# EAGLE board GDPHS_VGA - v1.3 (EAGLE 7.3.0), part 1 of 2
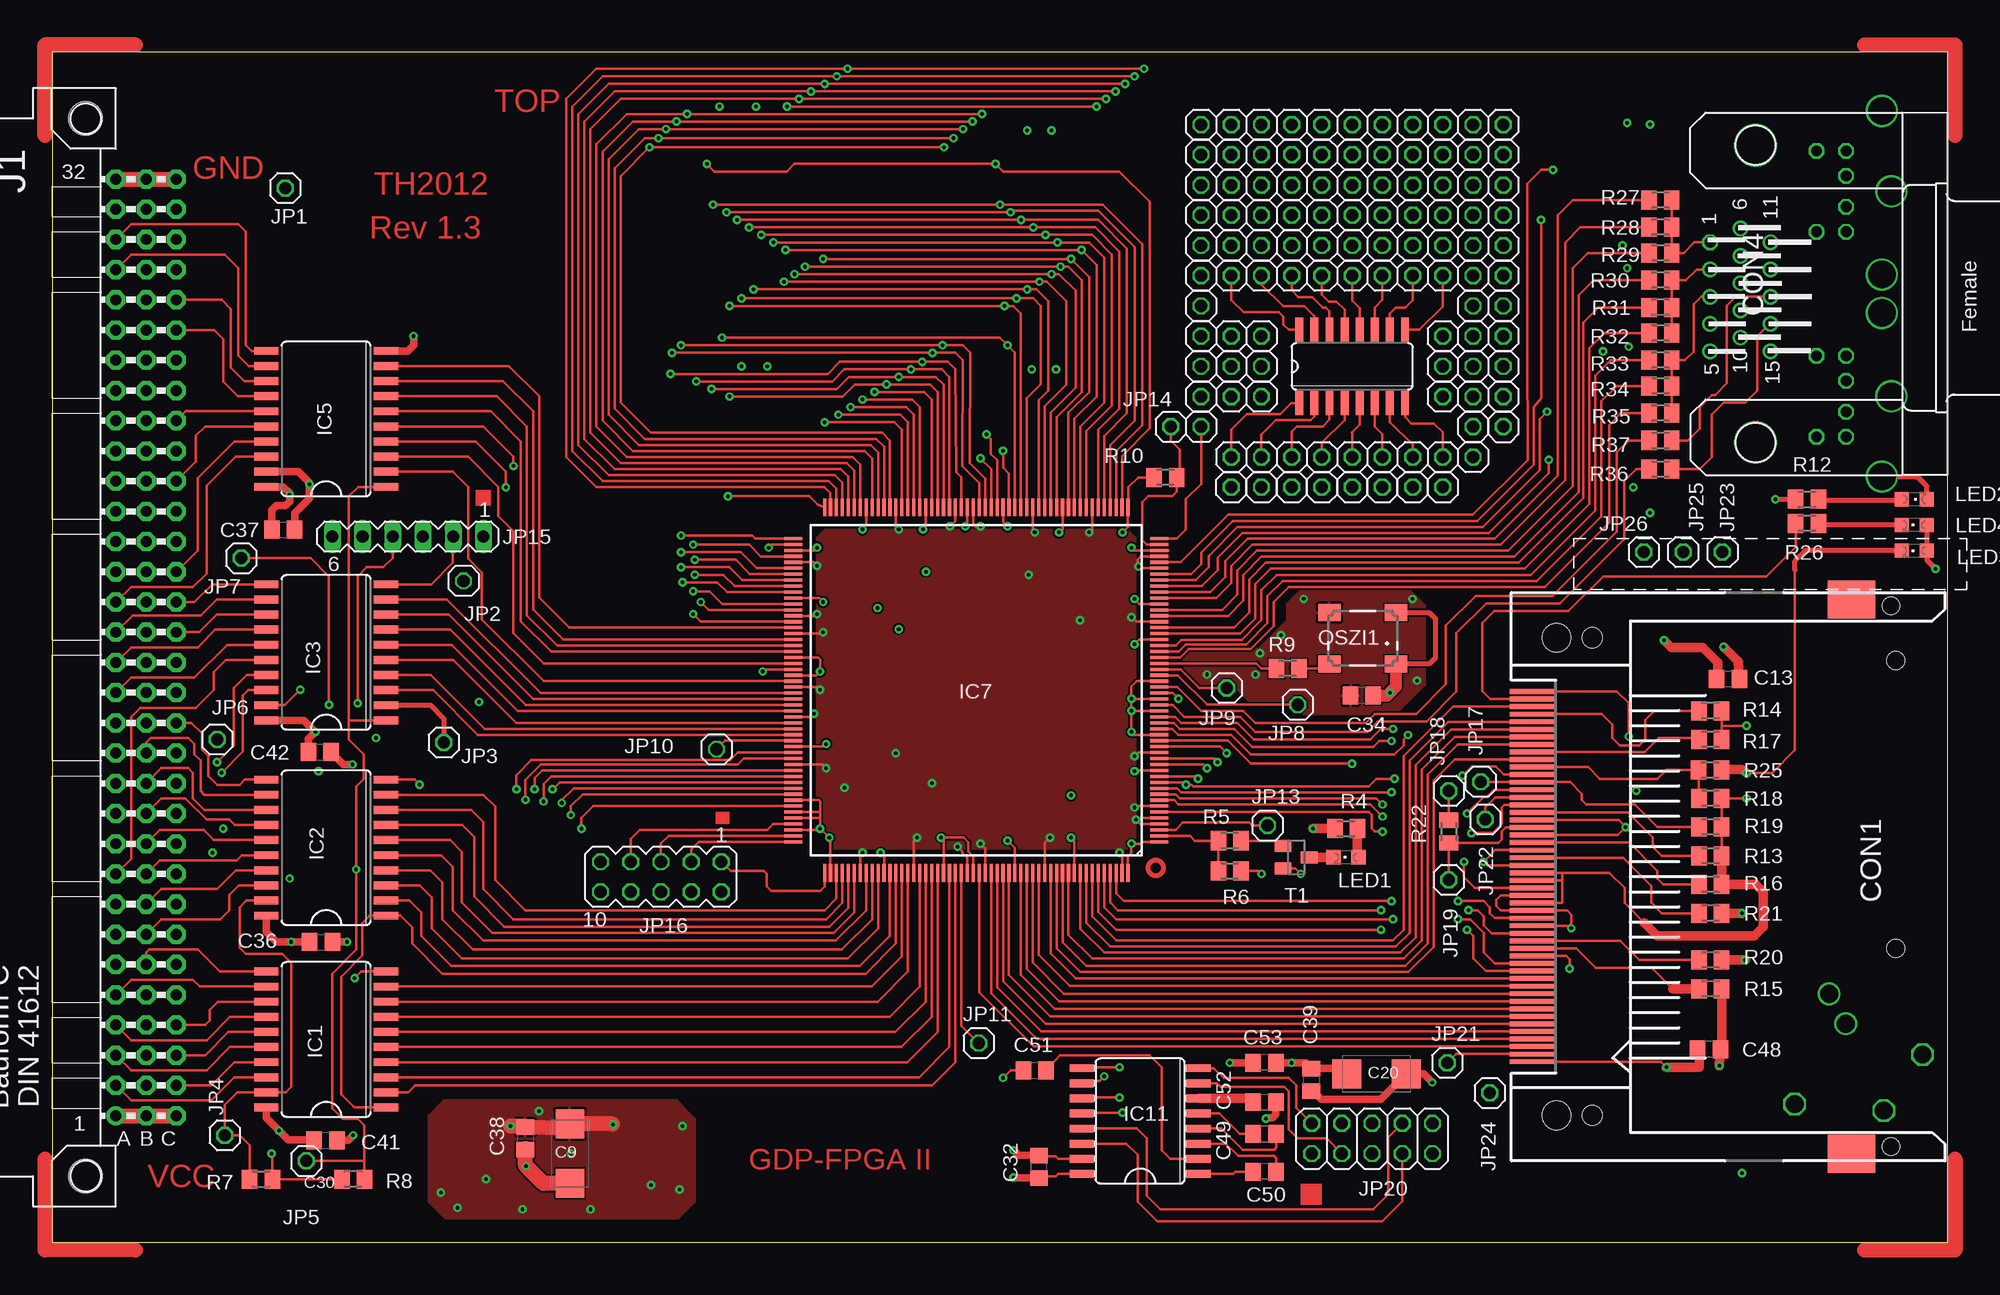
[diagram p5: board, top side]
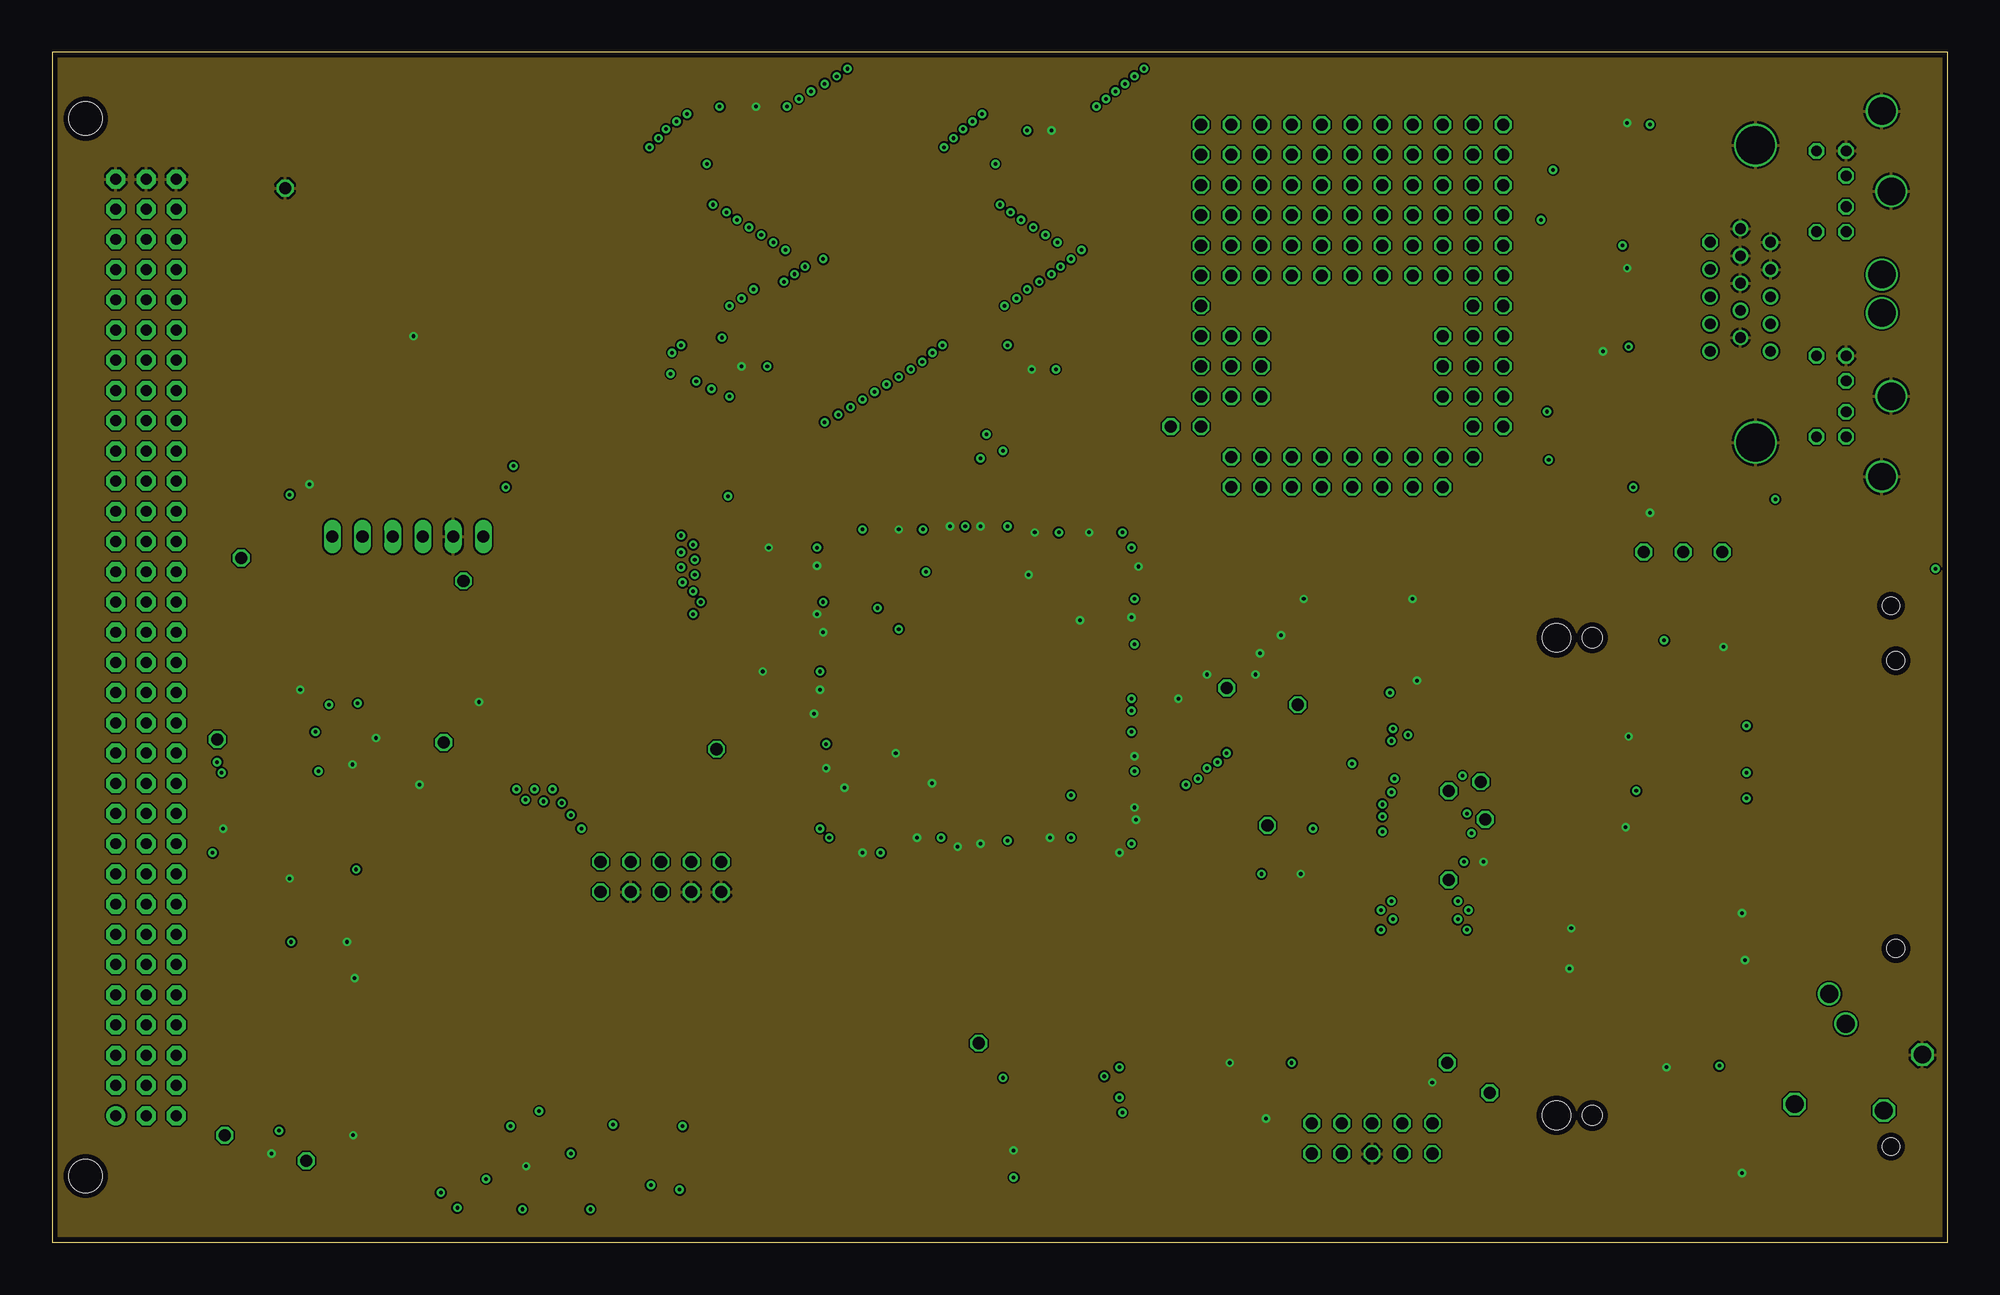
[diagram p6: board, inner layer GND$]
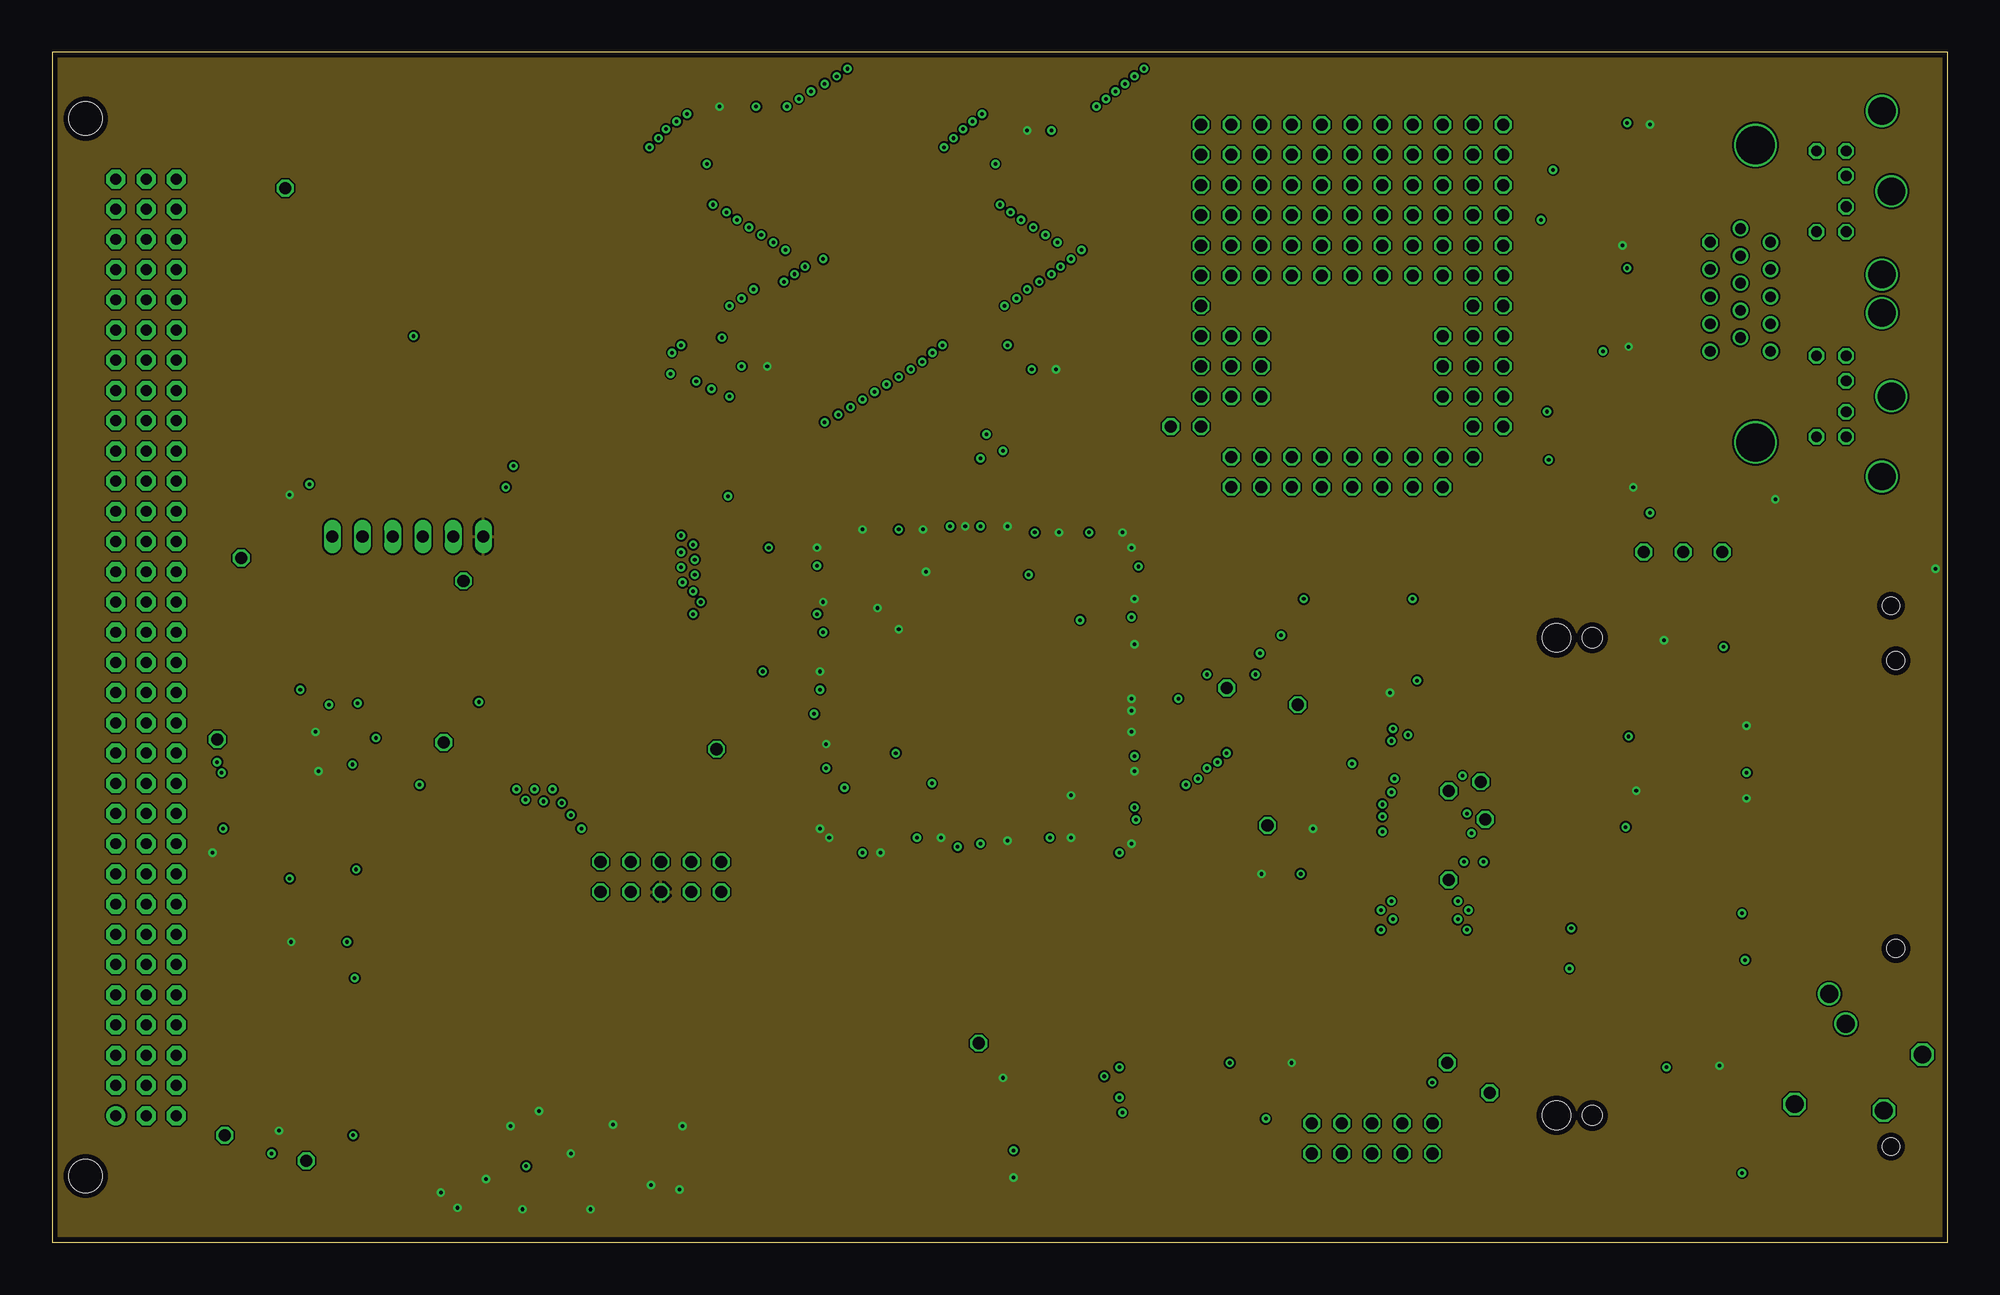
[diagram p7: board, inner layer VCC$]
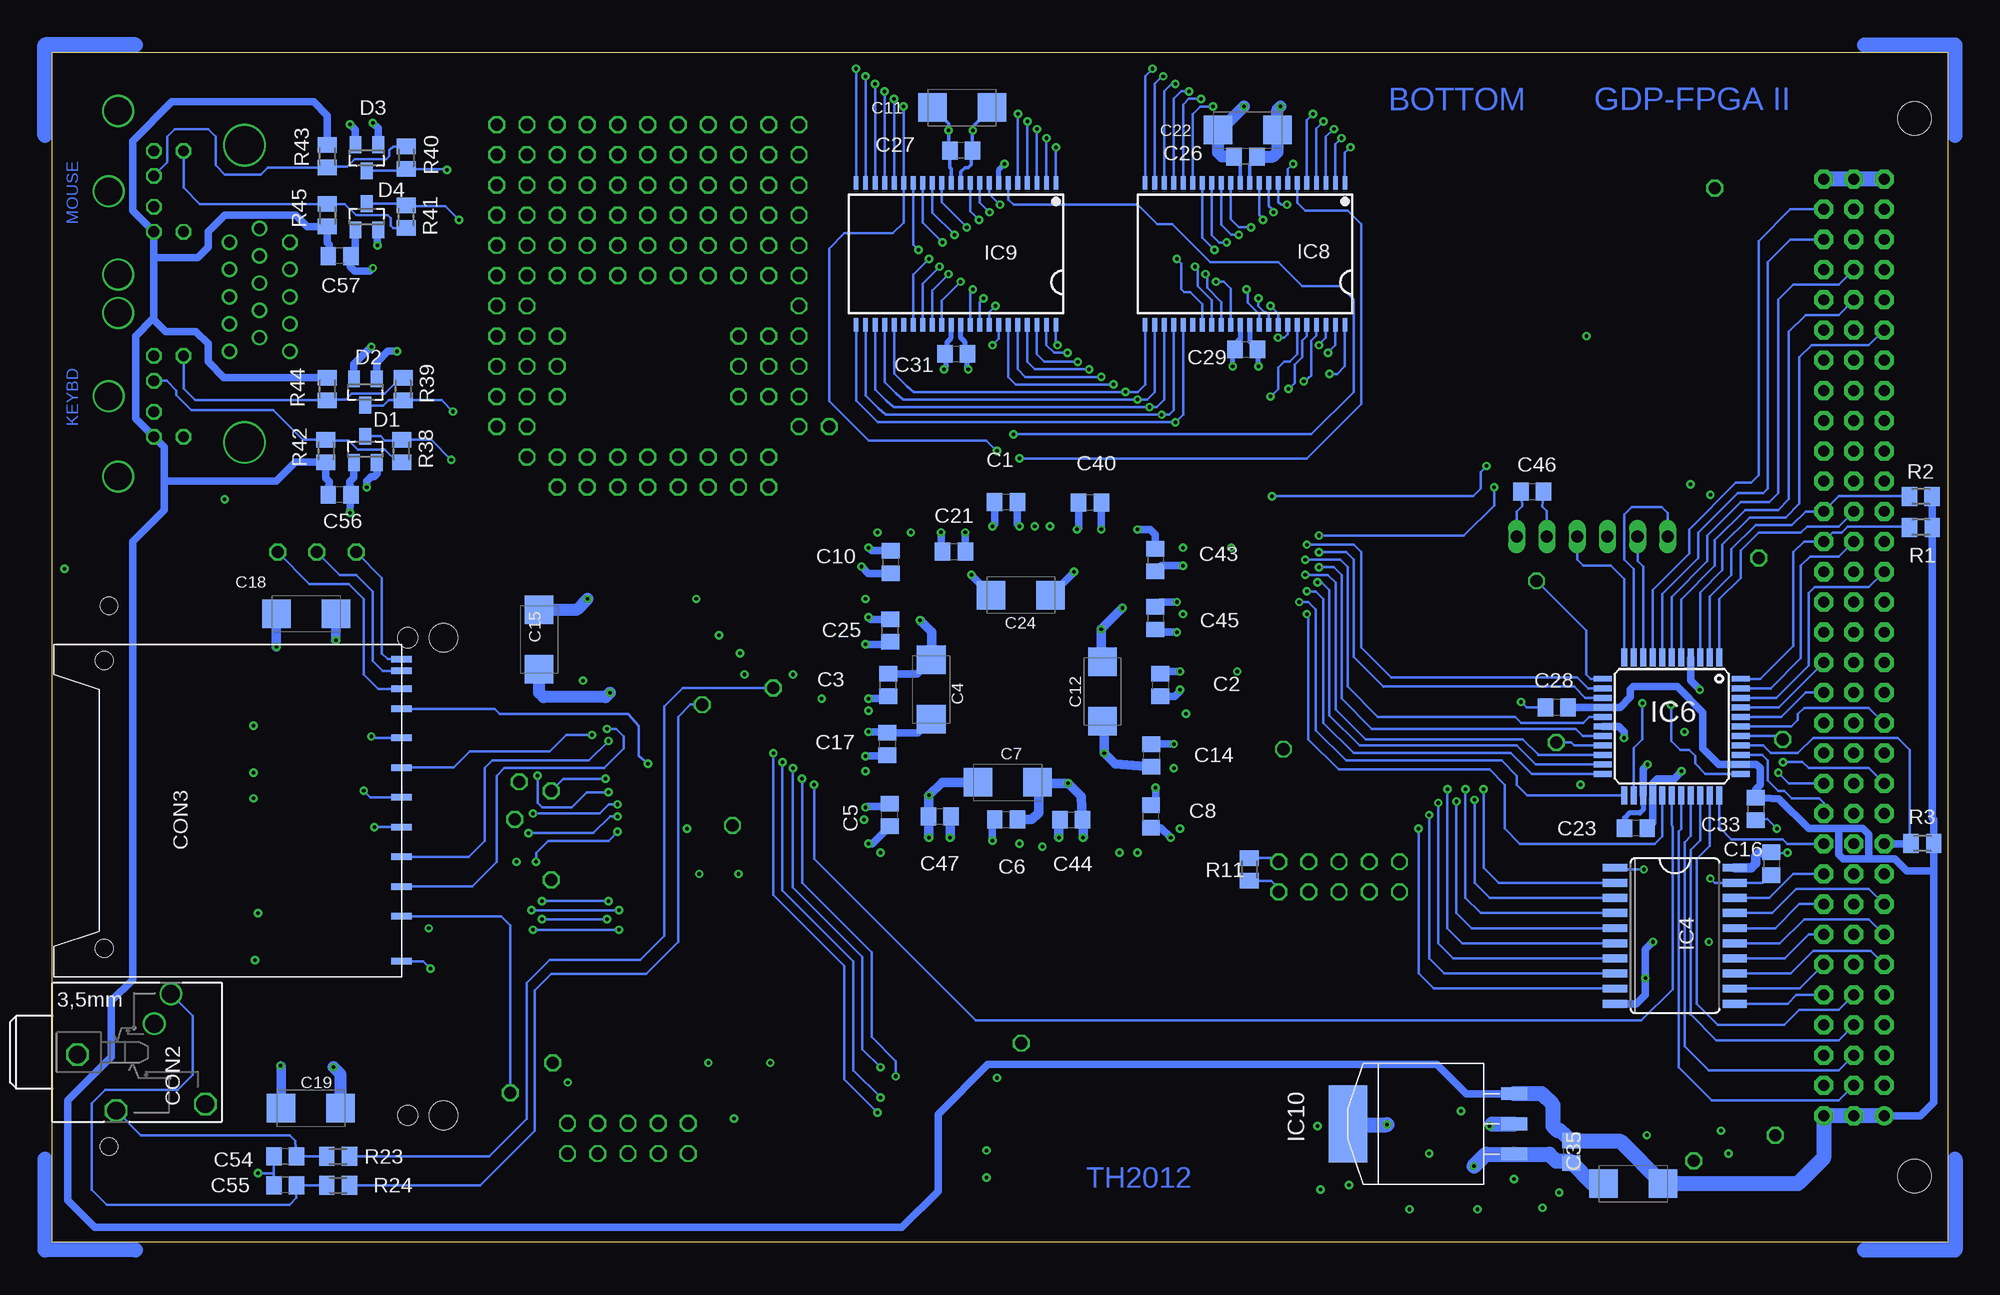
[diagram p8: board, bottom side, seen from below]

Size 159.26 x 100.03 mm. Coordinates in mm from the lower left corner, seen from the top.
Copper layers (1*2*3*16): Top 0.018mm / dielectric 0.36mm / GND$ 0.035mm / dielectric 0.71mm / VCC$ 0.035mm / dielectric 0.36mm / Bottom 0.018mm
Design rules "default": minimum track width 0.15mm, minimum drill 0.25mm, track to track 0.15mm, track to pad 0.15mm, pad to pad 0.15mm, via to via 0.15mm, smd to smd 0.15mm, copper to edge 0.45mm, drill to drill 0.3mm, minimum pad ring 0.2mm, minimum via ring 0.2mm, stop-mask expansion 0.1mm, vias tented up to drill 0mil, thermal gap 0.2mm

## Footprints (pad centres in the part's own frame; a part is rotated, then mirrored left to right if it is on the bottom)
C0805 = smd 1.3 x 1.5: 1 -0.95,0; 2 0.95,0
SMC_C = smd 2.4 x 2.4: + -2.5,0; - 2.5,0
CF-050-P2-X03-10-DS-1 = smd 0.41 x 3.75: 1 15.557,0.27; 2 14.287,0.27; 3 13.018,0.27; 4 11.748,0.27; 5 10.477,0.27; 6 9.207,0.27; 7 7.938,0.27; 8 6.668,0.27; 9 5.397,0.27; 10 4.128,0.27; 11 2.857,0.27; 12 1.587,0.27; 13 0.318,0.27; 14 -0.953,0.27; 15 -2.223,0.27; 16 -3.493,0.27; 17 -4.763,0.27; 18 -6.032,0.27; 19 -7.303,0.27; 20 -8.572,0.27; 21 -9.842,0.27; 22 -11.113,0.27; 23 -12.383,0.27; 24 -13.652,0.27; 25 -14.922,0.27; 26 14.922,0.27; 27 13.652,0.27; 28 12.383,0.27; 29 11.113,0.27; 30 9.842,0.27; 31 8.572,0.27; 32 7.303,0.27; 33 6.032,0.27; 34 4.763,0.27; 35 3.493,0.27; 36 2.223,0.27; 37 0.953,0.27; 38 -0.318,0.27; 39 -1.587,0.27; 40 -2.857,0.27; 41 -4.128,0.27; 42 -5.397,0.27; 43 -6.668,0.27; 44 -7.938,0.27; 45 -9.207,0.27; 46 -10.477,0.27; 47 -11.748,0.27; 48 -13.018,0.27; 49 -14.287,0.27; 50 -15.557,0.27 | smd 3.2 x 4: M1 -23.3,27.15; M2 23.3,27.15 | hole 1.676: 20.08,5.35; -20.08,5.35 | hole 1.422: -22.77,30.45; 22.7,30.45 | hole 2.4: -20.08,2.35; 20.08,2.35
PG203J = drill 1.499 octagon: 1 -5.004,-0.203; 4 5.74,-4.369; 5 -1.753,-4.902 | drill 1.499: 2 2.845,4.902; 3 1.448,2.388
FPS-009-2405-0 = smd 0.55 x 1.7: 1 2.5,0; 2 5,0; 3 7.5,0; 4 10,0; 5 12.5,0; 6 15,0; 7 17.43,0; 8 19.12,0; 9 0,0; CD 20.62,0; S1 -3.78,0; WP 21.62,0 | hole 1.5: -2.72,25; 21.48,25
MDSSV-BD06-HF15-B = drill 0.9 octagon: 1 4.331,12.311; 1-1 -7.314,0.881; 1-2 -9.915,0.881; 1-3 -5.213,0.881; 1-4 -12.015,0.881; 1-5 -5.213,3.381; 1-6 -12.015,3.381; 2-1 9.915,0.881; 2-2 7.314,0.881; 2-3 12.015,0.881; 2-4 5.213,0.881; 2-5 12.015,3.381; 2-6 5.213,3.381 | drill 0.9: 2 2.04,12.311; 3 -0.252,12.311; 4 -2.542,12.311; 5 -4.834,12.311; 6 5.476,9.771; 7 3.185,9.771; 8 0.894,9.771; 9 -1.397,9.771; 10 -3.688,9.771; 11 4.331,7.231; 12 2.04,7.231; 13 -0.252,7.231; 14 -2.542,7.231; 15 -4.834,7.231 | drill 2.301: S1 -15.367,-2.118; S2 -8.616,-2.918; S3 8.616,-2.918; S4 15.367,-2.118; S7 -1.615,-2.118; S8 1.615,-2.118 | drill 3.2: S5 12.495,8.501; S6 -12.495,8.501
SOT23 = smd 1 x 1.4: 1 -0.95,-1.1; 2 0.95,-1.1; 3 0,1.1
SO20W = smd 0.66 x 2.032: 1 -5.715,-5.029; 2 -4.445,-5.029; 3 -3.175,-5.029; 4 -1.905,-5.029; 5 -0.635,-5.029; 6 0.635,-5.029; 7 1.905,-5.029; 8 3.175,-5.029; 9 4.445,-5.029; 10 5.715,-5.029; 11 5.715,5.029; 12 4.445,5.029; 13 3.175,5.029; 14 1.905,5.029; 15 0.635,5.029; 16 -0.635,5.029; 17 -1.905,5.029; 18 -3.175,5.029; 19 -4.445,5.029; 20 -5.715,5.029
TQFP44 = smd 1.5 x 0.5: 1 -5.8,4; 2 -5.8,3.2; 3 -5.8,2.4; 4 -5.8,1.6; 5 -5.8,0.8; 6 -5.8,0; 7 -5.8,-0.8; 8 -5.8,-1.6; 9 -5.8,-2.4; 10 -5.8,-3.2; 11 -5.8,-4; 23 5.8,-4; 24 5.8,-3.2; 25 5.8,-2.4; 26 5.8,-1.6; 27 5.8,-0.8; 28 5.8,0; 29 5.8,0.8; 30 5.8,1.6; 31 5.8,2.4; 32 5.8,3.2; 33 5.8,4 | smd 0.5 x 1.5: 12 -4,-5.8; 13 -3.2,-5.8; 14 -2.4,-5.8; 15 -1.6,-5.8; 16 -0.8,-5.8; 17 0,-5.8; 18 0.8,-5.8; 19 1.6,-5.8; 20 2.4,-5.8; 21 3.2,-5.8; 22 4,-5.8; 34 4,5.8; 35 3.2,5.8; 36 2.4,5.8; 37 1.6,5.8; 38 0.8,5.8; 39 0,5.8; 40 -0.8,5.8; 41 -1.6,5.8; 42 -2.4,5.8; 43 -3.2,5.8; 44 -4,5.8
PQFP_208 = smd 1.5 x 0.26: 1 -15.367,12.75; 2 -15.367,12.25; 3 -15.367,11.75; 4 -15.367,11.25; 5 -15.367,10.75; 6 -15.367,10.25; 7 -15.367,9.75; 8 -15.367,9.25; 9 -15.367,8.75; 10 -15.367,8.25; 11 -15.367,7.75; 12 -15.367,7.25; 13 -15.367,6.75; 14 -15.367,6.25; 15 -15.367,5.75; 16 -15.367,5.25; 17 -15.367,4.75; 18 -15.367,4.25; 19 -15.367,3.75; 20 -15.367,3.25; 21 -15.367,2.75; 22 -15.367,2.25; 23 -15.367,1.75; 24 -15.367,1.25; 25 -15.367,0.75; 26 -15.367,0.25; 27 -15.367,-0.25; 28 -15.367,-0.75; 29 -15.367,-1.25; 30 -15.367,-1.75; 31 -15.367,-2.25; 32 -15.367,-2.75; 33 -15.367,-3.25; 34 -15.367,-3.75; 35 -15.367,-4.25; 36 -15.367,-4.75; 37 -15.367,-5.25; 38 -15.367,-5.75; 39 -15.367,-6.25; 40 -15.367,-6.75; 41 -15.367,-7.25; 42 -15.367,-7.75; 43 -15.367,-8.25; 44 -15.367,-8.75; 45 -15.367,-9.25; 46 -15.367,-9.75; 47 -15.367,-10.25; 48 -15.367,-10.75; 49 -15.367,-11.25; 50 -15.367,-11.75; 51 -15.367,-12.25; 52 -15.367,-12.75; 105 15.367,-12.75; 106 15.367,-12.25; 107 15.367,-11.75; 108 15.367,-11.25; 109 15.367,-10.75; 110 15.367,-10.25; 111 15.367,-9.75; 112 15.367,-9.25; 113 15.367,-8.75; 114 15.367,-8.25; 115 15.367,-7.75; 116 15.367,-7.25; 117 15.367,-6.75; 118 15.367,-6.25; 119 15.367,-5.75; 120 15.367,-5.25; 121 15.367,-4.75; 122 15.367,-4.25; 123 15.367,-3.75; 124 15.367,-3.25; 125 15.367,-2.75; 126 15.367,-2.25; 127 15.367,-1.75; 128 15.367,-1.25; 129 15.367,-0.75; 130 15.367,-0.25; 131 15.367,0.25; 132 15.367,0.75; 133 15.367,1.25; 134 15.367,1.75; 135 15.367,2.25; 136 15.367,2.75; 137 15.367,3.25; 138 15.367,3.75; 139 15.367,4.25; 140 15.367,4.75; 141 15.367,5.25; 142 15.367,5.75; 143 15.367,6.25; 144 15.367,6.75; 145 15.367,7.25; 146 15.367,7.75; 147 15.367,8.25; 148 15.367,8.75; 149 15.367,9.25; 150 15.367,9.75; 151 15.367,10.25; 152 15.367,10.75; 153 15.367,11.25; 154 15.367,11.75; 155 15.367,12.25; 156 15.367,12.75 | smd 0.26 x 1.5: 53 -12.75,-15.367; 54 -12.25,-15.367; 55 -11.75,-15.367; 56 -11.25,-15.367; 57 -10.75,-15.367; 58 -10.25,-15.367; 59 -9.75,-15.367; 60 -9.25,-15.367; 61 -8.75,-15.367; 62 -8.25,-15.367; 63 -7.75,-15.367; 64 -7.25,-15.367; 65 -6.75,-15.367; 66 -6.25,-15.367; 67 -5.75,-15.367; 68 -5.25,-15.367; 69 -4.75,-15.367; 70 -4.25,-15.367; 71 -3.75,-15.367; 72 -3.25,-15.367; 73 -2.75,-15.367; 74 -2.25,-15.367; 75 -1.75,-15.367; 76 -1.25,-15.367; 77 -0.75,-15.367; 78 -0.25,-15.367; 79 0.25,-15.367; 80 0.75,-15.367; 81 1.25,-15.367; 82 1.75,-15.367; 83 2.25,-15.367; 84 2.75,-15.367; 85 3.25,-15.367; 86 3.75,-15.367; 87 4.25,-15.367; 88 4.75,-15.367; 89 5.25,-15.367; 90 5.75,-15.367; 91 6.25,-15.367; 92 6.75,-15.367; 93 7.25,-15.367; 94 7.75,-15.367; 95 8.25,-15.367; 96 8.75,-15.367; 97 9.25,-15.367; 98 9.75,-15.367; 99 10.25,-15.367; 100 10.75,-15.367; 101 11.25,-15.367; 102 11.75,-15.367; 103 12.25,-15.367; 104 12.75,-15.367; 157 12.75,15.367; 158 12.25,15.367; 159 11.75,15.367; 160 11.25,15.367; 161 10.75,15.367; 162 10.25,15.367; 163 9.75,15.367; 164 9.25,15.367; 165 8.75,15.367; 166 8.25,15.367; 167 7.75,15.367; 168 7.25,15.367; 169 6.75,15.367; 170 6.25,15.367; 171 5.75,15.367; 172 5.25,15.367; 173 4.75,15.367; 174 4.25,15.367; 175 3.75,15.367; 176 3.25,15.367; 177 2.75,15.367; 178 2.25,15.367; 179 1.75,15.367; 180 1.25,15.367; 181 0.75,15.367; 182 0.25,15.367; 183 -0.25,15.367; 184 -0.75,15.367; 185 -1.25,15.367; 186 -1.75,15.367; 187 -2.25,15.367; 188 -2.75,15.367; 189 -3.25,15.367; 190 -3.75,15.367; 191 -4.25,15.367; 192 -4.75,15.367; 193 -5.25,15.367; 194 -5.75,15.367; 195 -6.25,15.367; 196 -6.75,15.367; 197 -7.25,15.367; 198 -7.75,15.367; 199 -8.25,15.367; 200 -8.75,15.367; 201 -9.25,15.367; 202 -9.75,15.367; 203 -10.25,15.367; 204 -10.75,15.367; 205 -11.25,15.367; 206 -11.75,15.367; 207 -12.25,15.367; 208 -12.75,15.367
TSOP44-400 = smd 0.406 x 1.143: 1 -10.4,-5.969; 2 -9.6,-5.969; 3 -8.8,-5.969; 4 -8,-5.969; 5 -7.2,-5.969; 6 -6.4,-5.969; 7 -5.6,-5.969; 8 -4.8,-5.969; 9 -4,-5.969; 10 -3.2,-5.969; 11 -2.4,-5.969; 12 -1.6,-5.969; 13 -0.8,-5.969; 14 0,-5.969; 15 0.8,-5.969; 16 1.6,-5.969; 17 2.4,-5.969; 18 3.2,-5.969; 19 4,-5.969; 20 4.8,-5.969; 21 5.6,-5.969; 22 6.4,-5.969; 23 6.4,5.969; 24 5.6,5.969; 25 4.8,5.969; 26 4,5.969; 27 3.2,5.969; 28 2.4,5.969; 29 1.6,5.969; 30 0.8,5.969; 31 0,5.969; 32 -0.8,5.969; 33 -1.6,5.969; 34 -2.4,5.969; 35 -3.2,5.969; 36 -4,5.969; 37 -4.8,5.969; 38 -5.6,5.969; 39 -6.4,5.969; 40 -7.2,5.969; 41 -8,5.969; 42 -8.8,5.969; 43 -9.6,5.969; 44 -10.4,5.969
MDD = smd 1.067 x 2.184: 1 0,0; 2 2.54,0; 3 5.08,0 | smd 6.452 x 3.251: 4 2.54,13.97
SO16L = smd 0.66 x 2.032: 1 -4.445,-4.902; 2 -3.175,-4.902; 3 -1.905,-4.902; 4 -0.635,-4.902; 5 0.635,-4.902; 6 1.905,-4.902; 7 3.175,-4.902; 8 4.445,-4.902; 9 4.445,4.902; 10 3.175,4.902; 11 1.905,4.902; 12 0.635,4.902; 13 -0.635,4.902; 14 -1.905,4.902; 15 -3.175,4.902; 16 -4.445,4.902
SO16 = smd 0.66 x 2.032: 1 -4.445,-3.073; 2 -3.175,-3.073; 3 -1.905,-3.073; 4 -0.635,-3.073; 5 0.635,-3.073; 6 1.905,-3.073; 7 3.175,-3.073; 8 4.445,-3.073; 9 4.445,3.073; 10 3.175,3.073; 11 1.905,3.073; 12 0.635,3.073; 13 -0.635,3.073; 14 -1.905,3.073; 15 -3.175,3.073; 16 -4.445,3.073
VG96K = drill 0.914 pad 1.6: A1 154.94,39.37 | drill 0.914 pad 1.6 octagon: A2 154.94,36.83; A3 154.94,34.29; A4 154.94,31.75; A5 154.94,29.21; A6 154.94,26.67; A7 154.94,24.13; A8 154.94,21.59; A9 154.94,19.05; A10 154.94,16.51; A11 154.94,13.97; A12 154.94,11.43; A13 154.94,8.89; A14 154.94,6.35; A15 154.94,3.81; A16 154.94,1.27; A17 154.94,-1.27; A18 154.94,-3.81; A19 154.94,-6.35; A20 154.94,-8.89; A21 154.94,-11.43; A22 154.94,-13.97; A23 154.94,-16.51; A24 154.94,-19.05; A25 154.94,-21.59; A26 154.94,-24.13; A27 154.94,-26.67; A28 154.94,-29.21; A29 154.94,-31.75; A30 154.94,-34.29; A31 154.94,-36.83; A32 154.94,-39.37; B1 152.4,39.37; B2 152.4,36.83; B3 152.4,34.29; B4 152.4,31.75; B5 152.4,29.21; B6 152.4,26.67; B7 152.4,24.13; B8 152.4,21.59; B9 152.4,19.05; B10 152.4,16.51; B11 152.4,13.97; B12 152.4,11.43; B13 152.4,8.89; B14 152.4,6.35; B15 152.4,3.81; B16 152.4,1.27; B17 152.4,-1.27; B18 152.4,-3.81; B19 152.4,-6.35; B20 152.4,-8.89; B21 152.4,-11.43; B22 152.4,-13.97; B23 152.4,-16.51; B24 152.4,-19.05; B25 152.4,-21.59; B26 152.4,-24.13; B27 152.4,-26.67; B28 152.4,-29.21; B29 152.4,-31.75; B30 152.4,-34.29; B31 152.4,-36.83; B32 152.4,-39.37; C1 149.86,39.37; C2 149.86,36.83; C3 149.86,34.29; C4 149.86,31.75; C5 149.86,29.21; C6 149.86,26.67; C7 149.86,24.13; C8 149.86,21.59; C9 149.86,19.05; C10 149.86,16.51; C11 149.86,13.97; C12 149.86,11.43; C13 149.86,8.89; C14 149.86,6.35; C15 149.86,3.81; C16 149.86,1.27; C17 149.86,-1.27; C18 149.86,-3.81; C19 149.86,-6.35; C20 149.86,-8.89; C21 149.86,-11.43; C22 149.86,-13.97; C23 149.86,-16.51; C24 149.86,-19.05; C25 149.86,-21.59; C26 149.86,-24.13; C27 149.86,-26.67; C28 149.86,-29.21; C29 149.86,-31.75; C30 149.86,-34.29; C31 149.86,-36.83; C32 149.86,-39.37 | hole 2.794: 157.48,44.45; 157.48,-44.45
1X01 = drill 1.016 octagon: 1 0,0
MA06-1 = drill 1.016 long: 1 -6.35,0; 2 -3.81,0; 3 -1.27,0; 4 1.27,0; 5 3.81,0; 6 6.35,0
MA05-2 = drill 1.016 octagon: 1 -5.08,-1.27; 2 -5.08,1.27; 3 -2.54,-1.27; 4 -2.54,1.27; 5 0,-1.27; 6 0,1.27; 7 2.54,-1.27; 8 2.54,1.27; 9 5.08,-1.27; 10 5.08,1.27
2X05 = drill 1.016 octagon: 1 -5.08,-1.27; 2 -5.08,1.27; 3 -2.54,-1.27; 4 -2.54,1.27; 5 0,-1.27; 6 0,1.27; 7 2.54,-1.27; 8 2.54,1.27; 9 5.08,-1.27; 10 5.08,1.27
CHIPLED_0805 = smd 1.2 x 1.2: A 0,-1.05; C 0,1.05
CFPS7X = smd 1.9 x 1.4: 1 -2.794,-2.794; 4 2.794,-2.794; 5 2.794,1.524; 8 -2.794,1.524
M0805 = smd 1.3 x 1.6: 1 -0.95,0; 2 0.95,0

## Placement (x,y rotation side)
C1  100n  [C0805]  79.13,62.23 0 bottom
C2  100n  [C0805]  66.17,46.84 270 bottom
C3  100n  [C0805]  89.02,46.84 90 bottom
C4  10µ/16  [SMC_C]  85.4,46.47 90 bottom
C5  100n  [C0805]  88.9,35.92 90 bottom
C6  100n  [C0805]  79.12,35.53 0 bottom
C7  10µ/16  [SMC_C]  78.97,38.66 0 bottom
C8  100n  [C0805]  66.93,35.79 90 bottom
C9  10µ/16  [SMC_C]  43.49,7.45 270 top
C10  100n  [C0805]  88.82,57.18 270 bottom
C11  10µ/16  [SMC_C]  82.82,95.39 180 bottom
C12  10µ/16  [SMC_C]  71.02,46.31 270 bottom
C13  100n  [C0805]  140.81,47.36 0 top
C14  100n  [C0805]  66.92,40.92 270 bottom
C15  10µ/16  [SMC_C]  118.36,50.67 90 bottom
C16  100n  [C0805]  14.81,31.82 270 bottom
C17  100n  [C0805]  89.1,41.88 270 bottom
C18  10µ/16  [SMC_C]  137.93,52.83 180 bottom
C19  10µ/16  [SMC_C]  137.53,11.27 0 bottom
C20  10µ/16  [SMC_C]  111.27,14.16 0 top
C21  100n  [C0805]  83.5,58.06 0 bottom
C22  10µ/16  [SMC_C]  58.81,93.5 180 bottom
C23  100n  [C0805]  26.19,34.81 180 bottom
C24  10µ/16  [SMC_C]  77.87,54.4 180 bottom
C25  100n  [C0805]  88.85,51.42 90 bottom
C26  100n  [C0805]  59,91.27 180 bottom
C27  100n  [C0805]  82.89,91.78 180 bottom
C28  100n  [C0805]  32.84,44.95 180 bottom
C29  100n  [C0805]  58.94,75.06 0 bottom
C30  10µ/16  [SMC_C]  26.42,4.93 180 bottom
C31  100n  [C0805]  83.31,74.68 0 bottom
C32  100n  [C0805]  82.91,6.35 90 top
C33  100n  [C0805]  16.13,36.42 270 bottom
C34  100n  [C0805]  110.04,45.96 180 top
C35  100n  [C0805]  31.62,7.59 270 bottom
C36  100n  [C0805]  22.57,25.24 0 top
C37  100n  [C0805]  19.41,59.9 0 top
C38  100n  [C0805]  39.74,8.73 270 top
C39  100n  [C0805]  105.78,13.66 270 top
C40  100n  [C0805]  72.07,62.19 0 bottom
C41  100n  [C0805]  22.95,8.57 0 top
C42  100n  [C0805]  22.46,41.21 0 top
C43  100n  [C0805]  66.57,57.35 270 bottom
C44  100n  [C0805]  73.65,35.52 0 bottom
C45  100n  [C0805]  66.57,52.46 270 bottom
C46  100n  [C0805]  34.9,63.11 0 bottom
C47  100n  [C0805]  84.7,35.81 0 bottom
C48  100n  [C0805]  139.21,16.21 180 top
C49  100n  [C0805]  101.85,9.11 0 top
C50  100n  [C0805]  101.85,5.93 180 top
C51  100n  [C0805]  82.55,14.45 0 top
C52  100n  [C0805]  101.85,11.78 0 top
C53  100n  [C0805]  101.85,15.09 180 top
C54  4n7  [C0805]  139.7,7.21 180 bottom
C55  4n7  [C0805]  139.7,4.8 180 bottom
C56  100n  [C0805]  135.13,62.84 180 bottom
C57  100n  [C0805]  135.13,82.91 180 bottom
CON1  IDE  [CF-050-P2-X03-10-DS-1]  124.05,30.74 270 top
CON2  PG203J  [PG203J]  152.15,15.98 0 bottom
CON3  FPS-009-2405-0  [FPS-009-2405-0]  129.92,27.41 90 bottom
CON4  MDSSV-BD06-HF15B  [MDSSV-BD06-HF15-B]  151.62,79.73 90 top
D1  BAT54S  [SOT23]  132.97,66.65 0 bottom
D2  BAT54S  [SOT23]  132.97,71.48 180 bottom
D3  BAT54S  [SOT23]  132.84,91.16 180 bottom
D4  BAT54S  [SOT23]  132.84,86.21 0 bottom
IC1  74LVC245  [SO20W]  23,17.05 90 top
IC2  74LVC245  [SO20W]  23,33.17 90 top
IC3  74LVC245  [SO20W]  23,49.59 90 top
IC4  74LVC245  [SO20W]  22.91,25.77 270 bottom
IC5  74LVC245  [SO20W]  23,69.22 90 top
IC6  XC9536SMD  [TQFP44]  23.18,43.37 270 bottom
IC7  LFXP6C_XX208-2  [PQFP_208]  77.64,46.41 180 top
IC8  CY7C1041CV33-TSOP44  [TSOP44-400]  61.04,83.09 180 bottom
IC9  CY7C1041CV33-TSOP44  [TSOP44-400]  85.33,83.1 180 bottom
IC10  LT1086-3.3V  [MDD]  36.42,7.41 90 bottom
IC11  MAX232ECWE  [SO16L]  91.41,10.19 90 top
IC12  74123D  [SO16]  109.22,73.63 0 top
J1  ECB-BUS  [VG96K]  160.27,50.01 180 top
JP1  [1X01]  19.56,88.62 0 top
JP2  [1X01]  34.54,55.6 0 top
JP3  [1X01]  32.89,42.01 0 top
JP4  [1X01]  14.48,8.99 0 top
JP5  [1X01]  21.34,6.83 0 top
JP6  [1X01]  13.84,42.27 0 top
JP7  [1X01]  15.88,57.51 0 top
JP8  [1X01]  104.65,45.19 0 top
JP9  [1X01]  98.68,46.58 0 top
JP10  [1X01]  55.81,41.45 0 top
JP11  [1X01]  77.85,16.74 0 top
JP12  [1X01]  96.52,68.55 0 top
JP13  [1X01]  102.11,35.03 0 top
JP14  [1X01]  93.98,68.55 0 top
JP15  XilinxProg  [MA06-1]  29.87,59.32 180 top
JP16  LatticeProg  [MA05-2]  51.14,30.72 180 top
JP17  [1X01]  120.02,38.71 0 top
JP18  [1X01]  117.35,37.95 0 top
JP19  [1X01]  117.35,30.45 0 top
JP20  RS232  [2X05]  110.89,8.72 0 top
JP21  [1X01]  117.22,15.09 0 top
JP22  [1X01]  120.4,35.53 0 top
JP23  [1X01]  140.34,58.01 0 top
JP24  [1X01]  120.78,12.55 0 top
JP25  [1X01]  137.03,58.01 0 top
JP26  [1X01]  133.73,58.01 0 top
JP27  [1X01]  99.06,66.01 0 top
JP28  [1X01]  101.6,66.01 0 top
JP29  [1X01]  104.14,81.25 0 top
JP30  [1X01]  101.6,81.25 0 top
JP31  [1X01]  104.14,66.01 0 top
JP32  [1X01]  116.84,81.25 0 top
JP33  [1X01]  114.3,81.25 0 top
JP34  [1X01]  111.76,66.01 0 top
JP35  [1X01]  114.3,66.01 0 top
JP36  [1X01]  111.76,81.25 0 top
JP37  [1X01]  121.92,83.79 0 top
JP38  [1X01]  121.92,81.25 0 top
JP39  [1X01]  121.92,88.87 0 top
JP40  [1X01]  121.92,86.33 0 top
JP41  [1X01]  121.92,78.71 0 top
JP42  [1X01]  121.92,91.41 0 top
JP43  [1X01]  116.84,76.17 0 top
JP44  [1X01]  121.92,76.17 0 top
JP45  [1X01]  101.6,76.17 0 top
JP46  [1X01]  116.84,73.63 0 top
JP47  [1X01]  121.92,73.63 0 top
JP48  [1X01]  101.6,73.63 0 top
JP49  [1X01]  116.84,71.09 0 top
JP50  [1X01]  119.38,66.01 0 top
JP51  [1X01]  101.6,71.09 0 top
JP52  [1X01]  119.38,68.55 0 top
JP53  [1X01]  121.92,93.95 0 top
JP54  [1X01]  99.06,63.47 90 top
JP55  [1X01]  101.6,63.47 90 top
JP56  [1X01]  104.14,63.47 90 top
JP57  [1X01]  106.68,63.47 90 top
JP58  [1X01]  109.22,63.47 90 top
JP59  [1X01]  111.76,63.47 90 top
JP60  [1X01]  114.3,63.47 90 top
JP61  [1X01]  116.84,63.47 90 top
JP62  [1X01]  121.92,68.55 90 top
JP63  [1X01]  106.68,81.25 0 top
JP64  [1X01]  106.68,66.01 0 top
JP65  [1X01]  109.22,66.01 0 top
JP66  [1X01]  109.22,81.25 0 top
JP67  [1X01]  99.06,81.25 0 top
JP68  [1X01]  116.84,66.01 0 top
JP69  [1X01]  99.06,91.41 0 top
JP70  [1X01]  104.14,91.41 0 top
JP71  [1X01]  114.3,91.41 0 top
JP72  [1X01]  109.22,91.41 0 top
JP73  [1X01]  109.22,86.33 0 top
JP74  [1X01]  119.38,91.41 0 top
JP75  [1X01]  116.84,86.33 0 top
JP76  [1X01]  99.06,86.33 0 top
JP77  [1X01]  114.3,86.33 0 top
JP78  [1X01]  104.14,86.33 0 top
JP79  [1X01]  101.6,91.41 0 top
JP80  [1X01]  101.6,86.33 0 top
JP81  [1X01]  106.68,91.41 0 top
JP82  [1X01]  106.68,86.33 0 top
JP83  [1X01]  111.76,91.41 0 top
JP84  [1X01]  111.76,86.33 0 top
JP85  [1X01]  99.06,88.87 0 top
JP86  [1X01]  116.84,91.41 0 top
JP87  [1X01]  106.68,88.87 0 top
JP88  [1X01]  119.38,86.33 0 top
JP89  [1X01]  121.92,71.09 0 top
JP90  [1X01]  101.6,88.87 0 top
JP91  [1X01]  119.38,81.25 0 top
JP92  [1X01]  104.14,88.87 0 top
JP93  [1X01]  116.84,83.79 0 top
JP94  [1X01]  104.14,83.79 0 top
JP95  [1X01]  96.52,91.41 0 top
JP96  [1X01]  114.3,83.79 0 top
JP97  [1X01]  111.76,83.79 0 top
JP98  [1X01]  96.52,88.87 0 top
JP99  [1X01]  99.06,83.79 0 top
JP100  [1X01]  109.22,83.79 0 top
JP101  [1X01]  119.38,83.79 0 top
JP102  [1X01]  101.6,83.79 0 top
JP103  [1X01]  119.38,88.87 0 top
JP104  [1X01]  106.68,83.79 0 top
JP105  [1X01]  111.76,88.87 0 top
JP106  [1X01]  109.22,88.87 0 top
JP107  [1X01]  116.84,88.87 0 top
JP108  [1X01]  114.3,88.87 0 top
JP109  [1X01]  99.06,93.95 0 top
JP110  [1X01]  101.6,93.95 0 top
JP111  [1X01]  119.38,78.71 0 top
JP112  [1X01]  111.76,93.95 0 top
JP113  [1X01]  96.52,86.33 0 top
JP114  [1X01]  119.38,93.95 0 top
JP115  [1X01]  116.84,93.95 0 top
JP116  [1X01]  114.3,93.95 0 top
JP117  [1X01]  96.52,83.79 0 top
JP118  [1X01]  96.52,76.17 0 top
JP119  [1X01]  99.06,71.09 0 top
JP120  [1X01]  99.06,73.63 0 top
JP121  [1X01]  96.52,81.25 0 top
JP122  [1X01]  96.52,73.63 0 top
JP123  [1X01]  119.38,71.09 0 top
JP124  [1X01]  99.06,76.17 0 top
JP125  [1X01]  96.52,78.71 0 top
JP126  [1X01]  96.52,71.09 0 top
JP127  [1X01]  119.38,73.63 0 top
JP128  [1X01]  119.38,76.17 0 top
JP129  [1X01]  96.52,93.95 0 top
JP130  [1X01]  104.14,93.95 0 top
JP131  [1X01]  106.68,93.95 0 top
JP132  [1X01]  109.22,93.95 0 top
LED1  YELLOW  [CHIPLED_0805]  108.71,32.36 90 top
LED2  GREEN  [CHIPLED_0805]  156.46,62.46 270 top
LED3  RED  [CHIPLED_0805]  156.46,58.14 90 top
LED4  YELLOW  [CHIPLED_0805]  156.46,60.3 90 top
OSZI1  CFPS-39 40MHz  [CFPS7X]  110.11,50.14 180 top
R1  10k  [M0805]  2.24,60.1 0 bottom
R2  10k  [M0805]  2.24,62.67 0 bottom
R3  10k  [M0805]  2.11,33.52 0 bottom
R4  220  [M0805]  108.71,34.77 180 top
R5  5k6  [M0805]  98.93,33.76 0 top
R6  10k  [M0805]  98.93,31.22 180 top
R7  0  [M0805]  17.53,5.31 180 top
R8  0  [M0805]  25.27,5.31 0 top
R9  330  [M0805]  103.8,48.24 0 top
R10  100  [M0805]  93.53,64.28 0 top
R11  4k7  [M0805]  58.67,31.34 90 bottom
R12  270  [M0805]  147.45,62.46 180 top
R13  10k  [M0805]  139.32,32.49 0 top
R14  10k  [M0805]  139.32,44.68 0 top
R15  10k  [M0805]  139.32,21.31 0 top
R16  10k  [M0805]  139.32,30.07 0 top
R17  10k  [M0805]  139.32,42.27 0 top
R18  10k  [M0805]  139.32,37.31 0 top
R19  0  [M0805]  139.32,34.9 0 top
R20  10k  [M0805]  139.32,23.72 0 top
R21  10k  [M0805]  139.32,27.66 0 top
R22  0  [M0805]  117.35,34.52 90 top
R23  3k3  [M0805]  135.25,7.21 180 bottom
R24  3k3  [M0805]  135.25,4.8 180 bottom
R25  270  [M0805]  139.3,39.69 0 top
R26  270  [M0805]  147.45,60.43 0 top
R27  470  [M0805]  135.13,87.6 0 top
R28  1K  [M0805]  135.13,85.32 0 top
R29  1K8  [M0805]  135.13,83.16 0 top
R30  470  [M0805]  135.13,80.87 0 top
R31  1k  [M0805]  135.13,78.59 0 top
R32  1k8  [M0805]  135.13,76.43 0 top
R33  470  [M0805]  135.13,74.14 0 top
R34  1k  [M0805]  135.13,71.98 0 top
R35  1k8  [M0805]  135.13,69.7 0 top
R36  47  [M0805]  135.13,65 180 top
R37  47  [M0805]  135.13,67.41 180 top
R38  120  [M0805]  129.92,66.52 270 bottom
R39  120  [M0805]  129.79,71.73 90 bottom
R40  120  [M0805]  129.54,91.16 90 bottom
R41  120  [M0805]  129.54,86.21 270 bottom
R42  2k  [M0805]  136.27,66.52 90 bottom
R43  2k  [M0805]  136.14,91.29 270 bottom
R44  2k  [M0805]  136.14,71.73 270 bottom
R45  2k  [M0805]  136.14,86.33 90 bottom
T1  BSS138  [SOT23]  104.52,32.36 270 top